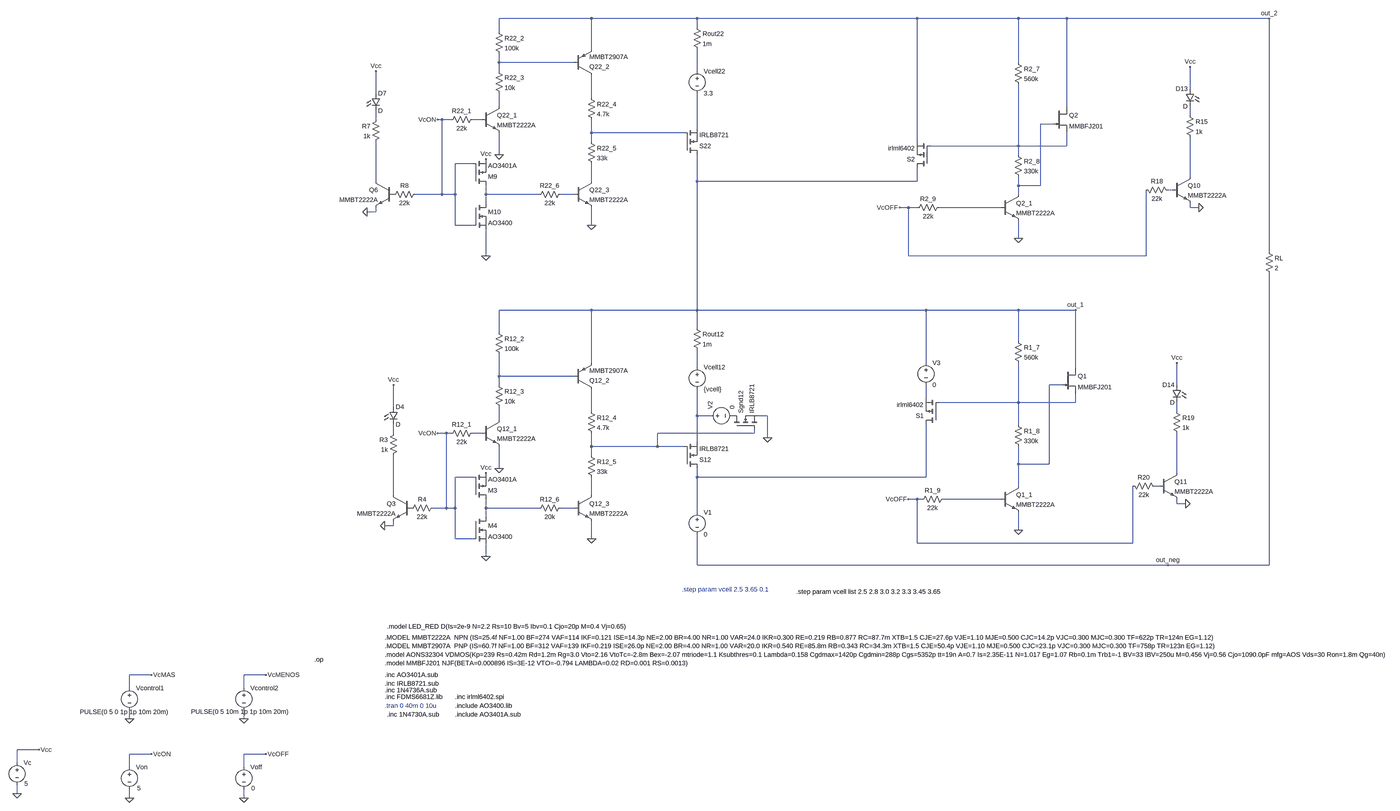
[diagram p0: schematic version_2x2.asc, whole sheet]
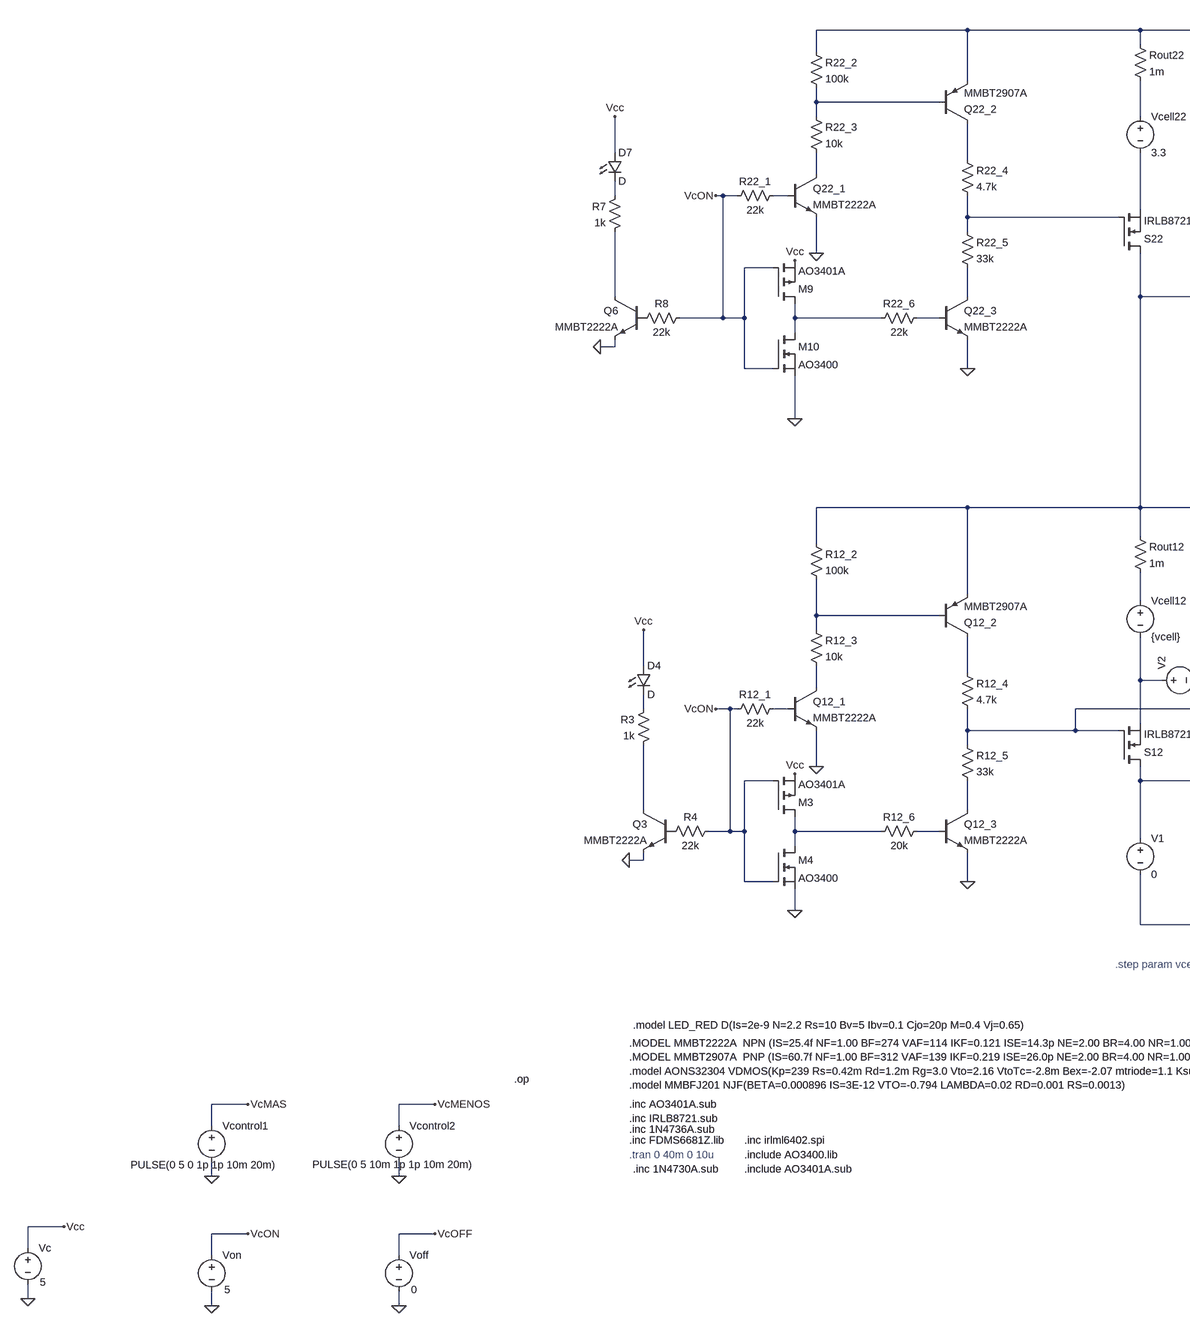
[diagram p1: schematic version_2x2.asc, part, row 1 of 1, column 1 of 2]
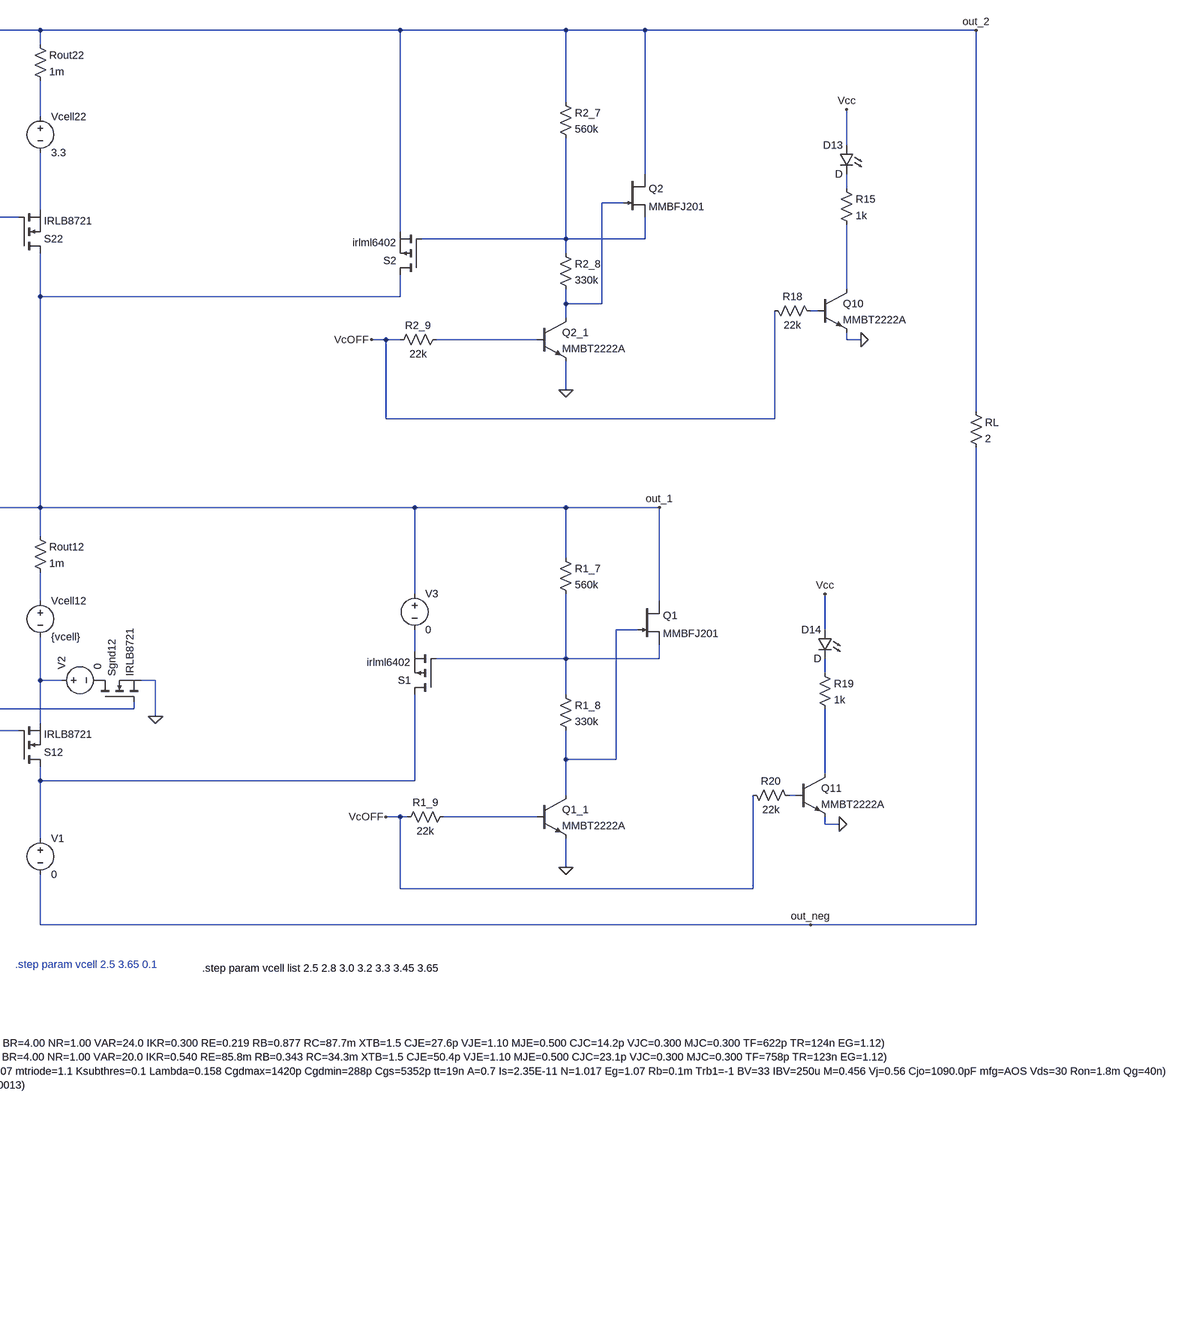
[diagram p2: schematic version_2x2.asc, part, row 1 of 1, column 2 of 2]
version_2x2.asc, the LTspice schematic file:
Version 4.1
SHEET 1 7672 2128
WIRE 528 -1456 192 -1456
WIRE 912 -1456 528 -1456
WIRE 1712 -1456 912 -1456
WIRE 2080 -1456 1712 -1456
WIRE 2256 -1456 2080 -1456
WIRE 2992 -1456 2256 -1456
WIRE 912 -1424 912 -1456
WIRE 192 -1408 192 -1456
WIRE 528 -1344 528 -1456
WIRE 192 -1296 192 -1328
WIRE 464 -1296 192 -1296
WIRE 2080 -1296 2080 -1456
WIRE 192 -1264 192 -1296
WIRE 912 -1264 912 -1344
WIRE 2704 -1200 2704 -1280
WIRE -256 -1184 -256 -1264
WIRE 528 -1168 528 -1248
WIRE 192 -1136 192 -1184
WIRE 2256 -1136 2256 -1456
WIRE 2704 -1104 2704 -1136
WIRE -256 -1088 -256 -1120
WIRE -16 -1088 -32 -1088
WIRE 16 -1088 -16 -1088
WIRE 128 -1088 96 -1088
WIRE 2208 -1072 2160 -1072
WIRE 912 -1056 912 -1184
WIRE 528 -1040 528 -1088
WIRE 864 -1040 528 -1040
WIRE 528 -1008 528 -1040
WIRE 1712 -1008 1712 -1456
WIRE 2080 -992 2080 -1216
WIRE 2080 -992 1760 -992
WIRE 2256 -992 2256 -1040
WIRE 2256 -992 2080 -992
WIRE 192 -960 192 -1040
WIRE 2080 -960 2080 -992
WIRE 96 -928 32 -928
WIRE 2704 -880 2704 -1024
WIRE -256 -864 -256 -1008
WIRE 528 -864 528 -928
WIRE 912 -864 912 -960
WIRE 1712 -864 1712 -912
WIRE 1712 -864 912 -864
WIRE 2080 -848 2080 -880
WIRE 2160 -848 2160 -1072
WIRE 2160 -848 2080 -848
WIRE 2640 -832 2624 -832
WIRE -16 -816 -16 -1088
WIRE -16 -816 -112 -816
WIRE 32 -816 32 -928
WIRE 32 -816 -16 -816
WIRE 144 -816 144 -848
WIRE 336 -816 144 -816
WIRE 464 -816 416 -816
WIRE 2080 -816 2080 -848
WIRE 144 -784 144 -816
WIRE 1680 -768 1648 -768
WIRE 1712 -768 1680 -768
WIRE 2016 -768 1792 -768
WIRE 2704 -768 2704 -784
WIRE 2736 -768 2704 -768
WIRE -256 -752 -256 -768
WIRE -256 -752 -288 -752
WIRE 32 -704 32 -816
WIRE 96 -704 32 -704
WIRE 528 -704 528 -768
WIRE 2080 -656 2080 -720
WIRE 2992 -608 2992 -1456
WIRE 144 -592 144 -688
WIRE 1680 -592 1680 -768
WIRE 2544 -592 2544 -832
WIRE 2544 -592 1680 -592
WIRE 528 -368 192 -368
WIRE 912 -368 912 -864
WIRE 912 -368 528 -368
WIRE 1744 -368 912 -368
WIRE 2080 -368 1744 -368
WIRE 2288 -368 2080 -368
WIRE 912 -304 912 -368
WIRE 192 -288 192 -368
WIRE 2080 -256 2080 -368
WIRE 528 -176 528 -368
WIRE 1744 -176 1744 -368
WIRE 912 -160 912 -224
WIRE 2288 -160 2288 -368
WIRE 192 -128 192 -208
WIRE 464 -128 192 -128
WIRE 192 -96 192 -128
WIRE 2240 -96 2192 -96
WIRE 2656 -96 2656 -176
WIRE 1744 -48 1744 -96
WIRE 2080 -32 2080 -176
WIRE 2080 -32 1792 -32
WIRE 2288 -32 2288 -64
WIRE 2288 -32 2080 -32
WIRE -192 -16 -192 -96
WIRE 528 0 528 -80
WIRE 2656 0 2656 -32
WIRE 912 16 912 -80
WIRE 960 16 912 16
WIRE 1168 16 1136 16
WIRE 192 32 192 -16
WIRE 2080 48 2080 -32
WIRE -192 80 -192 48
WIRE 0 80 -32 80
WIRE 16 80 0 80
WIRE 128 80 96 80
WIRE 1120 80 1120 64
WIRE 1120 80 768 80
WIRE 1168 96 1168 16
WIRE 912 112 912 16
WIRE 528 128 528 80
WIRE 768 128 768 80
WIRE 768 128 528 128
WIRE 864 128 768 128
WIRE 528 160 528 128
WIRE 2080 192 2080 128
WIRE 2192 192 2192 -96
WIRE 2192 192 2080 192
WIRE 192 208 192 128
WIRE 2656 224 2656 80
WIRE 96 240 32 240
WIRE 912 240 912 208
WIRE 1744 240 1744 48
WIRE 1744 240 912 240
WIRE 2080 272 2080 192
WIRE 2592 272 2576 272
WIRE -192 304 -192 160
WIRE 528 304 528 240
WIRE 1712 320 1680 320
WIRE 1728 320 1712 320
WIRE 2016 320 1808 320
WIRE 2656 336 2656 320
WIRE 2688 336 2656 336
WIRE 0 352 0 80
WIRE 0 352 -48 352
WIRE 32 352 32 240
WIRE 32 352 0 352
WIRE 144 352 144 320
WIRE 336 352 144 352
WIRE 464 352 416 352
WIRE 912 368 912 240
WIRE 144 384 144 352
WIRE -192 416 -192 400
WIRE -192 416 -224 416
WIRE 2080 432 2080 368
WIRE 32 464 32 352
WIRE 96 464 32 464
WIRE 528 464 528 400
WIRE 1712 480 1712 320
WIRE 2496 480 2496 272
WIRE 2496 480 1712 480
WIRE 144 528 144 480
WIRE 912 560 912 448
WIRE 2624 560 912 560
WIRE 2992 560 2992 -528
WIRE 2992 560 2624 560
WIRE -1072 1024 -1152 1024
WIRE -656 1024 -736 1024
WIRE -1152 1072 -1152 1024
WIRE -736 1072 -736 1024
WIRE -1152 1184 -1152 1152
WIRE -736 1184 -736 1152
WIRE -1504 1296 -1584 1296
WIRE -1072 1312 -1152 1312
WIRE -656 1312 -736 1312
WIRE -1584 1344 -1584 1296
WIRE -1152 1360 -1152 1312
WIRE -736 1360 -736 1312
WIRE -1584 1456 -1584 1424
WIRE -1152 1472 -1152 1440
WIRE -736 1472 -736 1440
FLAG 192 208 0
FLAG 528 464 0
FLAG 192 -960 0
FLAG 528 -704 0
FLAG -1152 1184 0
FLAG -736 1184 0
FLAG -1072 1024 VcMAS
FLAG -656 1024 VcMENOS
FLAG -736 1472 0
FLAG -656 1312 VcOFF
FLAG -1152 1472 0
FLAG -1072 1312 VcON
FLAG -32 -1088 VcON
FLAG -32 80 VcON
FLAG 2624 560 out_neg
FLAG 2288 -368 out_1
FLAG 2080 432 0
FLAG 1680 320 VcOFF
FLAG 2080 -656 0
FLAG 1648 -768 VcOFF
FLAG 1168 96 0
FLAG 2992 -1456 out_2
FLAG -224 416 0
FLAG -288 -752 0
FLAG 2736 -768 0
FLAG 2688 336 0
FLAG 2656 -176 Vcc
FLAG -192 -96 Vcc
FLAG -256 -1264 Vcc
FLAG 2704 -1280 Vcc
FLAG -1584 1456 0
FLAG -1504 1296 Vcc
FLAG 144 528 0
FLAG 144 224 Vcc
FLAG 144 -592 0
FLAG 144 -944 Vcc
SYMBOL npn 464 304 R0
SYMATTR InstName Q12_3
SYMATTR Value MMBT2222A
SYMBOL res 512 144 R0
SYMATTR InstName R12_5
SYMATTR Value 33k
SYMBOL res 512 -16 R0
SYMATTR InstName R12_4
SYMATTR Value 4.7k
SYMBOL npn 128 32 R0
SYMATTR InstName Q12_1
SYMATTR Value MMBT2222A
SYMBOL res 176 -112 R0
SYMATTR InstName R12_3
SYMATTR Value 10k
SYMBOL res 176 -304 R0
SYMATTR InstName R12_2
SYMATTR Value 100k
SYMBOL res 432 336 R90
WINDOW 0 0 56 VBottom 2
WINDOW 3 32 56 VTop 2
SYMATTR InstName R12_6
SYMATTR Value 20k
SYMBOL voltage 912 -176 R0
WINDOW 123 0 0 Left 0
WINDOW 39 0 0 Left 0
SYMATTR InstName Vcell12
SYMATTR Value {vcell}
SYMBOL pnp 464 -80 M180
SYMATTR InstName Q12_2
SYMATTR Value MMBT2907A
SYMBOL nmos 864 208 M180
SYMATTR InstName S12
SYMATTR Value IRLB8721
SYMATTR Prefix X
SYMBOL npn 464 -864 R0
SYMATTR InstName Q22_3
SYMATTR Value MMBT2222A
SYMBOL res 512 -1024 R0
SYMATTR InstName R22_5
SYMATTR Value 33k
SYMBOL res 512 -1184 R0
SYMATTR InstName R22_4
SYMATTR Value 4.7k
SYMBOL npn 128 -1136 R0
SYMATTR InstName Q22_1
SYMATTR Value MMBT2222A
SYMBOL res 176 -1280 R0
SYMATTR InstName R22_3
SYMATTR Value 10k
SYMBOL res 176 -1424 R0
SYMATTR InstName R22_2
SYMATTR Value 100k
SYMBOL res 432 -832 R90
WINDOW 0 0 56 VBottom 2
WINDOW 3 32 56 VTop 2
SYMATTR InstName R22_6
SYMATTR Value 22k
SYMBOL voltage 912 -1280 R0
WINDOW 123 0 0 Left 0
WINDOW 39 0 0 Left 0
SYMATTR InstName Vcell22
SYMATTR Value 3.3
SYMBOL pnp 464 -1248 M180
SYMATTR InstName Q22_2
SYMATTR Value MMBT2907A
SYMBOL nmos 864 -960 M180
SYMATTR InstName S22
SYMATTR Value IRLB8721
SYMATTR Prefix X
SYMBOL voltage -1152 1056 R0
WINDOW 3 -180 103 Left 2
WINDOW 123 0 0 Left 0
WINDOW 39 0 0 Left 0
SYMATTR Value PULSE(0 5 0 1p 1p 10m 20m)
SYMATTR InstName Vcontrol1
SYMBOL voltage -736 1056 R0
WINDOW 3 -192 102 Left 2
WINDOW 123 0 0 Left 0
WINDOW 39 0 0 Left 0
SYMATTR Value PULSE(0 5 10m 1p 1p 10m 20m)
SYMATTR InstName Vcontrol2
SYMBOL voltage -736 1344 R0
WINDOW 3 27 92 Left 2
WINDOW 123 0 0 Left 0
WINDOW 39 0 0 Left 0
SYMATTR Value 0
SYMATTR InstName Voff
SYMBOL voltage -1152 1344 R0
WINDOW 3 28 92 Left 2
WINDOW 123 0 0 Left 0
WINDOW 39 0 0 Left 0
SYMATTR Value 5
SYMATTR InstName Von
SYMBOL res 112 -1104 R90
WINDOW 0 0 56 VBottom 2
WINDOW 3 32 56 VTop 2
SYMATTR InstName R22_1
SYMATTR Value 22k
SYMBOL res 112 64 R90
WINDOW 0 0 56 VBottom 2
WINDOW 3 32 56 VTop 2
SYMATTR InstName R12_1
SYMATTR Value 22k
SYMBOL res 896 -320 R0
SYMATTR InstName Rout12
SYMATTR Value 1m
SYMBOL res 896 -1440 R0
SYMATTR InstName Rout22
SYMATTR Value 1m
SYMBOL npn 2016 272 R0
SYMATTR InstName Q1_1
SYMATTR Value MMBT2222A
SYMBOL res 1824 304 R90
WINDOW 0 0 56 VBottom 2
WINDOW 3 32 56 VTop 2
SYMATTR InstName R1_9
SYMATTR Value 22k
SYMBOL res 2064 -272 R0
SYMATTR InstName R1_7
SYMATTR Value 560k
SYMBOL npn 2016 -816 R0
SYMATTR InstName Q2_1
SYMATTR Value MMBT2222A
SYMBOL res 1808 -784 R90
WINDOW 0 0 56 VBottom 2
WINDOW 3 32 56 VTop 2
SYMATTR InstName R2_9
SYMATTR Value 22k
SYMBOL res 2064 -1312 R0
SYMATTR InstName R2_7
SYMATTR Value 560k
SYMBOL nmos 1040 64 R270
SYMATTR InstName Sgnd12
SYMATTR Value IRLB8721
SYMATTR Prefix X
SYMBOL pmos 1760 -912 R180
SYMATTR InstName S2
SYMATTR Value irlml6402
SYMATTR Prefix X
SYMBOL pmos 1792 48 R180
SYMATTR InstName S1
SYMATTR Value irlml6402
SYMATTR Prefix X
SYMBOL voltage 912 352 R0
WINDOW 123 0 0 Left 0
WINDOW 39 0 0 Left 0
SYMATTR InstName V1
SYMATTR Value 0
SYMBOL npn -128 304 M0
SYMATTR InstName Q3
SYMATTR Value MMBT2222A
SYMBOL res -176 64 M0
SYMATTR InstName R3
SYMATTR Value 1k
SYMBOL res -32 336 R90
WINDOW 0 0 56 VBottom 2
WINDOW 3 32 56 VTop 2
SYMATTR InstName R4
SYMATTR Value 22k
SYMBOL LED -208 -16 R0
SYMATTR InstName D4
SYMBOL npn -192 -864 M0
SYMATTR InstName Q6
SYMATTR Value MMBT2222A
SYMBOL res -240 -1104 M0
SYMATTR InstName R7
SYMATTR Value 1k
SYMBOL res -96 -832 R90
WINDOW 0 0 56 VBottom 2
WINDOW 3 32 56 VTop 2
SYMATTR InstName R8
SYMATTR Value 22k
SYMBOL LED -272 -1184 R0
SYMATTR InstName D7
SYMBOL npn 2640 -880 R0
SYMATTR InstName Q10
SYMATTR Value MMBT2222A
SYMBOL res 2688 -1120 R0
SYMATTR InstName R15
SYMATTR Value 1k
SYMBOL res 2528 -848 M90
WINDOW 0 0 56 VBottom 2
WINDOW 3 32 56 VTop 2
SYMATTR InstName R18
SYMATTR Value 22k
SYMBOL LED 2720 -1200 M0
SYMATTR InstName D13
SYMBOL npn 2592 224 R0
SYMATTR InstName Q11
SYMATTR Value MMBT2222A
SYMBOL res 2640 -16 R0
SYMATTR InstName R19
SYMATTR Value 1k
SYMBOL res 2480 256 M90
WINDOW 0 0 56 VBottom 2
WINDOW 3 32 56 VTop 2
SYMATTR InstName R20
SYMATTR Value 22k
SYMBOL LED 2672 -96 M0
SYMATTR InstName D14
SYMBOL res 2064 32 R0
SYMATTR InstName R1_8
SYMATTR Value 330k
SYMBOL res 2064 -976 R0
SYMATTR InstName R2_8
SYMATTR Value 330k
SYMBOL res 2976 -624 R0
SYMATTR InstName RL
SYMATTR Value 2
SYMBOL voltage -1584 1328 R0
WINDOW 3 27 92 Left 2
WINDOW 123 0 0 Left 0
WINDOW 39 0 0 Left 0
SYMATTR Value 5
SYMATTR InstName Vc
SYMBOL pmos 96 320 M180
SYMATTR InstName M3
SYMATTR Value AO3401A
SYMATTR Prefix X
SYMBOL nmos 96 384 R0
SYMATTR InstName M4
SYMATTR Value AO3400
SYMATTR Prefix X
SYMBOL pmos 96 -848 M180
SYMATTR InstName M9
SYMATTR Value AO3401A
SYMATTR Prefix X
SYMBOL nmos 96 -784 R0
SYMATTR InstName M10
SYMATTR Value AO3400
SYMATTR Prefix X
SYMBOL voltage 944 16 R270
WINDOW 123 0 0 Left 0
WINDOW 39 0 0 Left 0
SYMATTR InstName V2
SYMATTR Value 0
SYMBOL njf 2240 -160 R0
SYMATTR InstName Q1
SYMATTR Value MMBFJ201
SYMBOL njf 2208 -1136 R0
SYMATTR InstName Q2
SYMATTR Value MMBFJ201
SYMBOL voltage 1744 -192 R0
WINDOW 123 0 0 Left 0
WINDOW 39 0 0 Left 0
SYMATTR InstName V3
SYMATTR Value 0
TEXT -224 1136 Left 2 ;.tran 0 40m 0 10u
TEXT -224 888 Left 2 !.MODEL MMBT2222A  NPN (IS=25.4f NF=1.00 BF=274 VAF=114 IKF=0.121 ISE=14.3p NE=2.00 BR=4.00 NR=1.00 VAR=24.0 IKR=0.300 RE=0.219 RB=0.877 RC=87.7m XTB=1.5 CJE=27.6p VJE=1.10 MJE=0.500 CJC=14.2p VJC=0.300 MJC=0.300 TF=622p TR=124n EG=1.12)\n.MODEL MMBT2907A  PNP (IS=60.7f NF=1.00 BF=312 VAF=139 IKF=0.219 ISE=26.0p NE=2.00 BR=4.00 NR=1.00 VAR=20.0 IKR=0.540 RE=85.8m RB=0.343 RC=34.3m XTB=1.5 CJE=50.4p VJE=1.10 MJE=0.500 CJC=23.1p VJC=0.300 MJC=0.300 TF=758p TR=123n EG=1.12)\n.model AONS32304 VDMOS(Kp=239 Rs=0.42m Rd=1.2m Rg=3.0 Vto=2.16 VtoTc=-2.8m Bex=-2.07 mtriode=1.1 Ksubthres=0.1 Lambda=0.158 Cgdmax=1420p Cgdmin=288p Cgs=5352p tt=19n A=0.7 Is=2.35E-11 N=1.017 Eg=1.07 Rb=0.1m Trb1=-1 BV=33 IBV=250u M=0.456 Vj=0.56 Cjo=1090.0pF mfg=AOS Vds=30 Ron=1.8m Qg=40n)\n.model MMBFJ201 NJF(BETA=0.000896 IS=3E-12 VTO=-0.794 LAMBDA=0.02 RD=0.001 RS=0.0013)
TEXT -224 1024 Left 2 !.inc AO3401A.sub\n.inc IRLB8721.sub
TEXT -224 1080 Left 2 !.inc 1N4736A.sub
TEXT -224 1104 Left 2 !.inc FDMS6681Z.lib
TEXT -216 1168 Left 2 !.inc 1N4730A.sub
TEXT -216 848 Left 2 !.model LED_RED D(Is=2e-9 N=2.2 Rs=10 Bv=5 Ibv=0.1 Cjo=20p M=0.4 Vj=0.65)
TEXT 32 1104 Left 2 !.inc irlml6402.spi
TEXT 32 1136 Left 2 !.include AO3400.lib
TEXT 32 1168 Left 2 !.include AO3401A.sub
TEXT -480 968 Left 2 !.op
TEXT 856 648 Left 2 ;.step param vcell 2.5 3.65 0.1
TEXT 1272 656 Left 2 !.step param vcell list 2.5 2.8 3.0 3.2 3.3 3.45 3.65

The netlist it stands for:
* version_2x2.asc
Q12_3 N035 N038 0 0 MMBT2222A
R12_5 N030 N035 33k
R12_4 N024 N030 4.7k
Q12_1 N027 N029 0 0 MMBT2222A
R12_3 N020 N027 10k
R12_2 out_1 N020 100k
R12_6 N038 N037 20k
Vcell12 N019 N026 {vcell}
Q12_2 N024 N020 out_1 0 MMBT2907A
X§S12 N032 N030 N026 IRLB8721  ; pins D G S
Q22_3 N014 N017 0 0 MMBT2222A
R22_5 N010 N014 33k
R22_4 N003 N010 4.7k
Q22_1 N004 N007 0 0 MMBT2222A
R22_3 N001 N004 10k
R22_2 out_2 N001 100k
R22_6 N017 N016 22k
Vcell22 N002 N009 3.3
Q22_2 N003 N001 out_2 0 MMBT2907A
X§S22 out_1 N010 N009 IRLB8721  ; pins D G S
Vcontrol1 VcMAS 0 PULSE(0 5 0 1p 1p 10m 20m)
Vcontrol2 VcMENOS 0 PULSE(0 5 10m 1p 1p 10m 20m)
Voff VcOFF 0 0
Von VcON 0 5
R22_1 N007 VcON 22k
R12_1 N029 VcON 22k
Rout12 out_1 N019 1m
Rout22 out_2 N002 1m
Q1_1 N021 N036 0 0 MMBT2222A
R1_9 N036 VcOFF 22k
R1_7 out_1 N023 560k
Q2_1 N008 N018 0 0 MMBT2222A
R2_9 N018 VcOFF 22k
R2_7 out_2 N011 560k
X§Sgnd12 P001 N030 0 IRLB8721  ; pins D G S
X§S2 out_1 N011 out_2 irlml6402  ; pins D G S
X§S1 N032 N023 N022 irlml6402  ; pins D G S
V1 N032 out_neg 0
Q3 N034 P002 0 0 MMBT2222A
R3 N028 N034 1k
R4 VcON P002 22k
D4 Vcc N028 D
Q6 N013 P003 0 0 MMBT2222A
R7 N006 N013 1k
R8 VcON P003 22k
D7 Vcc N006 D
Q10 N012 N015 0 0 MMBT2222A
R15 N005 N012 1k
R18 VcOFF N015 22k
D13 Vcc N005 D
Q11 N031 N033 0 0 MMBT2222A
R19 N025 N031 1k
R20 VcOFF N033 22k
D14 Vcc N025 D
R1_8 N023 N021 330k
R2_8 N011 N008 330k
RL out_2 out_neg 2
Vc Vcc 0 5
X§M3 N037 VcON Vcc AO3401A  ; pins D G S
X§M4 N037 VcON 0 AO3400  ; pins D G S
X§M9 N016 VcON Vcc AO3401A  ; pins D G S
X§M10 N016 VcON 0 AO3400  ; pins D G S
V2 N026 P001 0
J§Q1 out_1 N021 N023 MMBFJ201
J§Q2 out_2 N008 N011 MMBFJ201
V3 out_1 N022 0
.model D D
.lib standard.dio
.model NPN NPN
.model PNP PNP
.lib standard.bjt
.model NJF NJF
.model PJF PJF
.lib standard.jft
* .tran 0 40m 0 10u
.MODEL MMBT2222A  NPN (IS=25.4f NF=1.00 BF=274 VAF=114 IKF=0.121 ISE=14.3p NE=2.00 BR=4.00 NR=1.00 VAR=24.0 IKR=0.300 RE=0.219 RB=0.877 RC=87.7m XTB=1.5 CJE=27.6p VJE=1.10 MJE=0.500 CJC=14.2p VJC=0.300 MJC=0.300 TF=622p TR=124n EG=1.12)
.MODEL MMBT2907A  PNP (IS=60.7f NF=1.00 BF=312 VAF=139 IKF=0.219 ISE=26.0p NE=2.00 BR=4.00 NR=1.00 VAR=20.0 IKR=0.540 RE=85.8m RB=0.343 RC=34.3m XTB=1.5 CJE=50.4p VJE=1.10 MJE=0.500 CJC=23.1p VJC=0.300 MJC=0.300 TF=758p TR=123n EG=1.12)
.model AONS32304 VDMOS(Kp=239 Rs=0.42m Rd=1.2m Rg=3.0 Vto=2.16 VtoTc=-2.8m Bex=-2.07 mtriode=1.1 Ksubthres=0.1 Lambda=0.158 Cgdmax=1420p Cgdmin=288p Cgs=5352p tt=19n A=0.7 Is=2.35E-11 N=1.017 Eg=1.07 Rb=0.1m Trb1=-1 BV=33 IBV=250u M=0.456 Vj=0.56 Cjo=1090.0pF mfg=AOS Vds=30 Ron=1.8m Qg=40n)
.model MMBFJ201 NJF(BETA=0.000896 IS=3E-12 VTO=-0.794 LAMBDA=0.02 RD=0.001 RS=0.0013)
.inc AO3401A.sub
.inc IRLB8721.sub
.inc 1N4736A.sub
.inc FDMS6681Z.lib
.inc 1N4730A.sub
.model LED_RED D(Is=2e-9 N=2.2 Rs=10 Bv=5 Ibv=0.1 Cjo=20p M=0.4 Vj=0.65)
.inc irlml6402.spi
.include AO3400.lib
.include AO3401A.sub
.op
* .step param vcell 2.5 3.65 0.1
.step param vcell list 2.5 2.8 3.0 3.2 3.3 3.45 3.65
.backanno
.end